# EAGLE schematic TriStateBuffer2 (EAGLE 9.2.2)
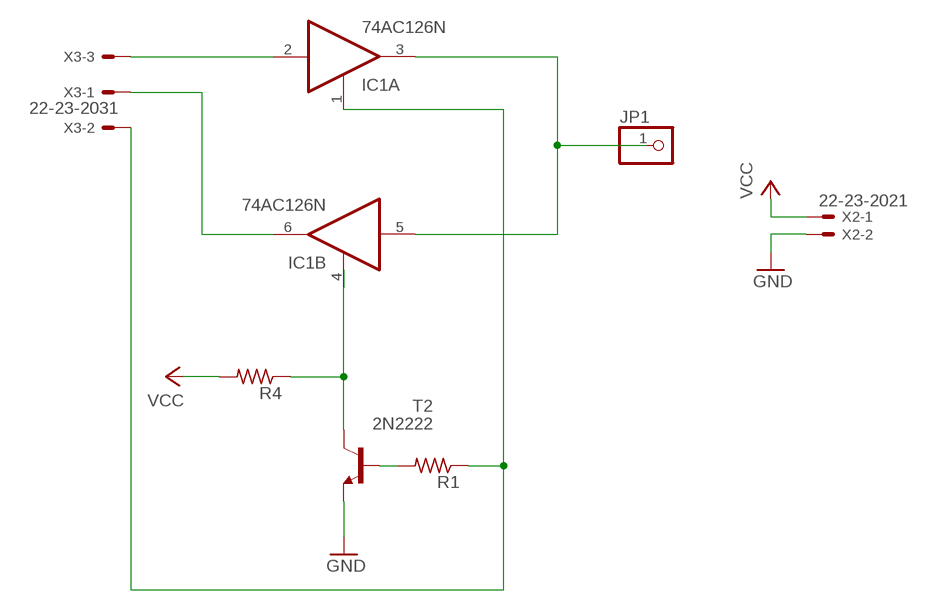
[diagram p0: schematic, sheet 1]

## Parts
IC1  74AC126N  [DIL14]
JP1  PINHD-1X1  [1X01]
R1  R-US_0309/12  [0309/12]
R4  R-US_0309/12  [0309/12]
T2  2N2222  [TO92-EBC-OVAL]
X2  22-23-2021  [22-23-2021]
X3  22-23-2031  [22-23-2031]

## Nets
GND: T2.E X2.2
N$1: IC1.6(B:O) X3.1
N$2: IC1.2(A:I) X3.3
N$3: IC1.3(A:O) IC1.5(B:I) JP1.1
N$5: R1.2 T2.B
N$6: IC1.4(B:OE) R4.1 T2.C
N$8: IC1.1(A:OE) R1.1 X3.2
VCC: R4.2 X2.1
Unconnected: IC1.8(C:O) IC1.9(C:I) IC1.10(C:OE) IC1.11(D:O) IC1.12(D:I) IC1.13(D:OE)

## Power pins joined to a net without a drawn wire
GND: IC1.7(P:GND)
VCC: IC1.14(P:VCC)

## Library data of the parts
IC1 = 74xx-eu:74*126: Quad bus BUFFER, 3-state
JP1 = adafruit:PINHD-1X1: Pin header 1x1 for 0.1" spacing With round pins
R1 R4 = adafruit:R-US_: RESISTOR, American symbol
T2 = adafruit:2N2222: NPN TRANSISTOR Big oval pads
X2 = con-molex:22-23-2021: .100" (2.54mm) Center Header - 2 Pin; MF: MOLEX; MPN: 22-23-2021; OC_FARNELL: 1462926; OC_NEWARK: 25C3832
X3 = con-molex:22-23-2031: .100" (2.54mm) Center Header - 3 Pin; MF: MOLEX; MPN: 22-23-2031; OC_FARNELL: 1462950; OC_NEWARK: 30C0862